# EAGLE schematic Imagenotifier (EAGLE 7.5.0)
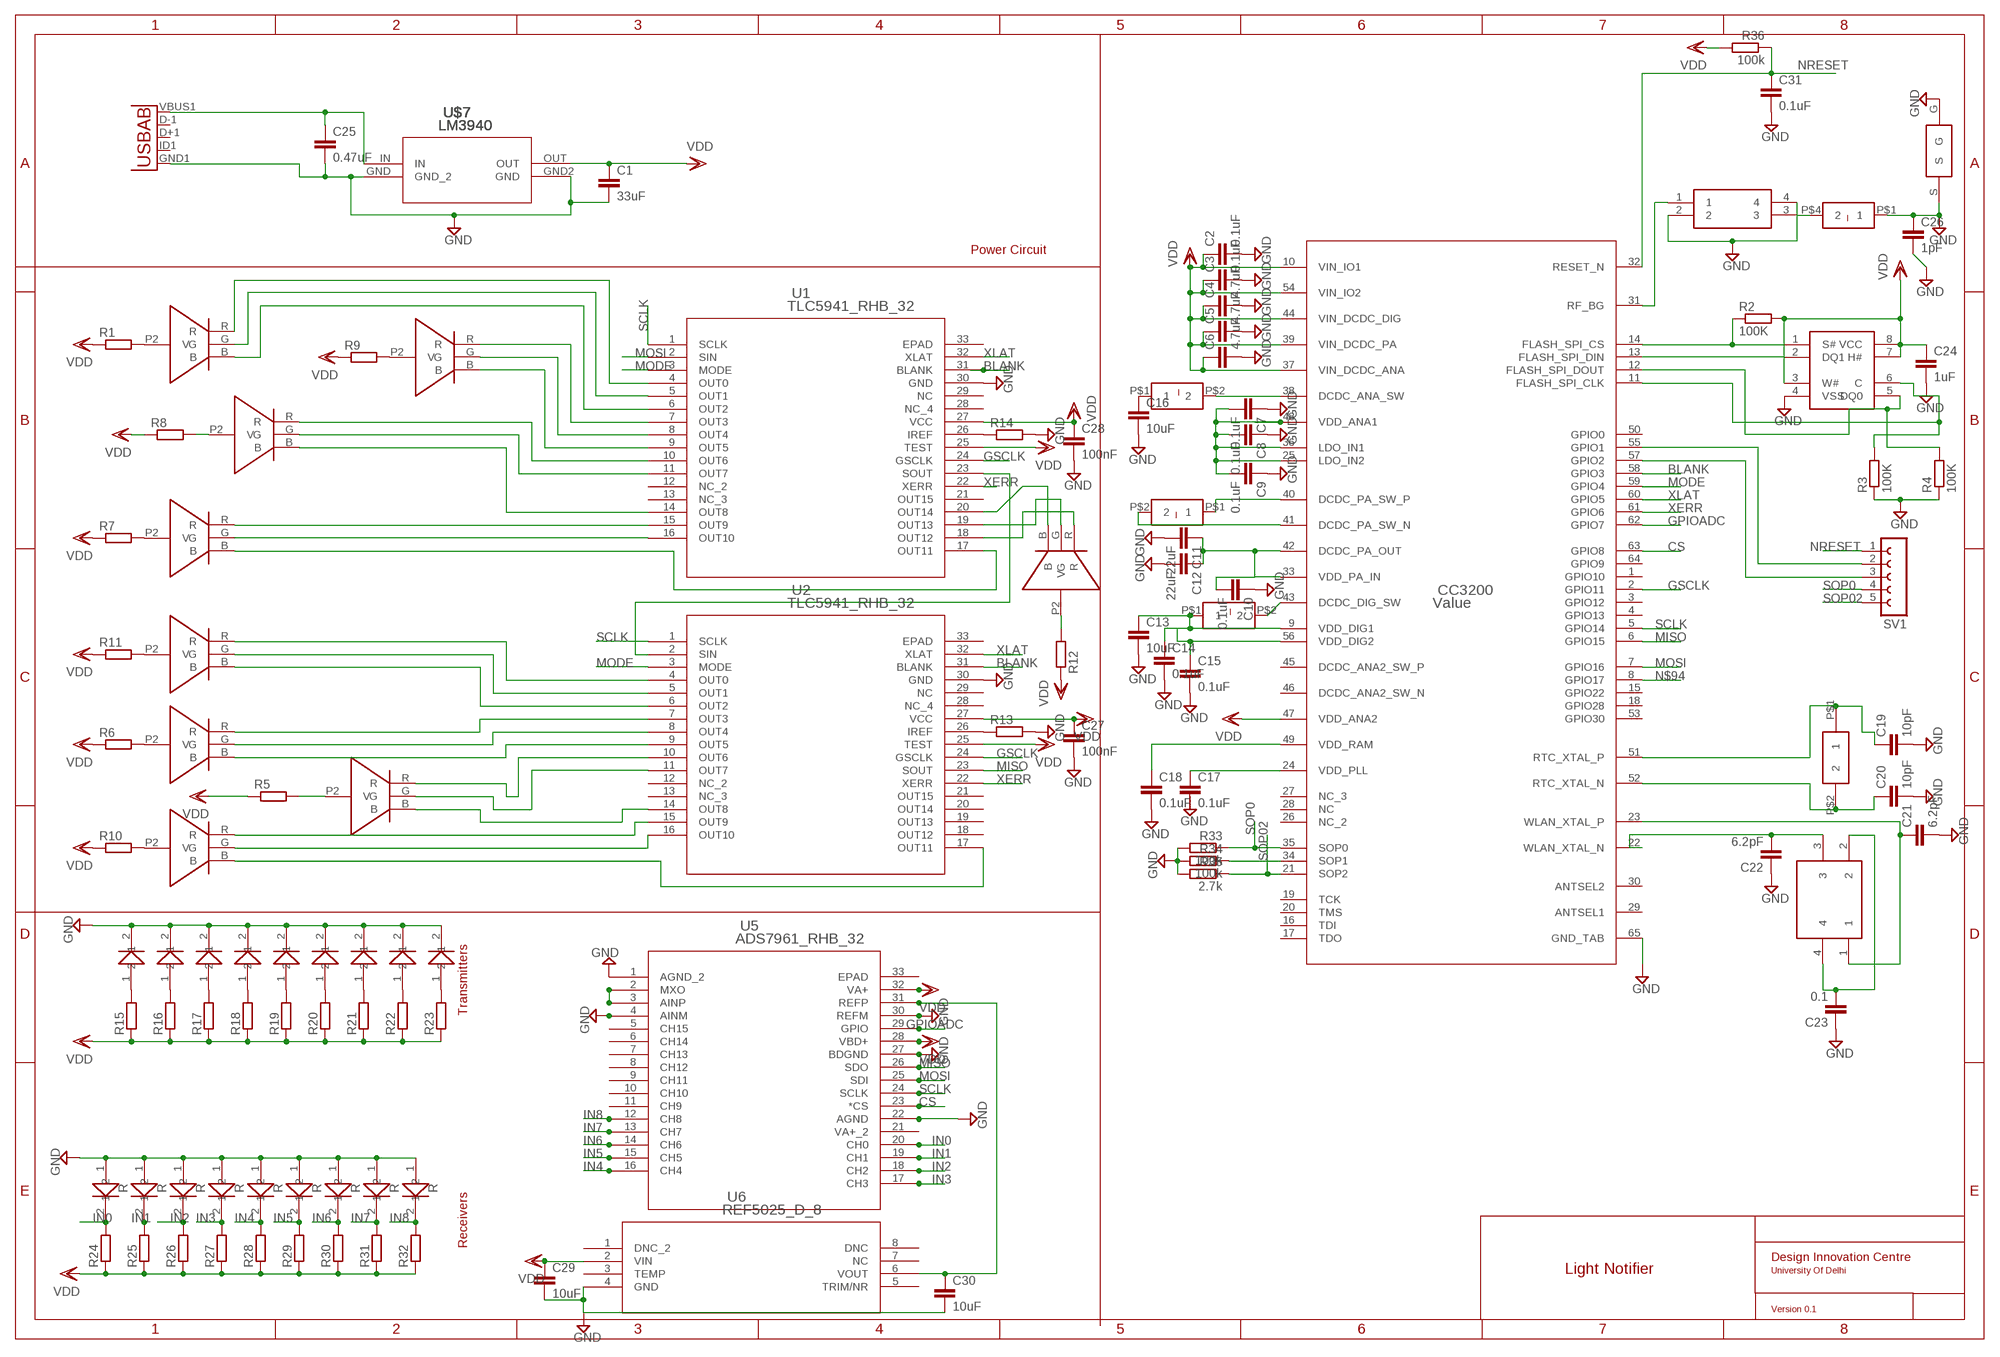
[diagram p0: schematic, sheet 1]

## Parts
1  IRTRANS  [IRTRANSCIEVER]
C1  33uF  CC1206  [C1206]
C2  0.1uF  CAP0805  [0805]
C3  0.1uF  CAP0805  [0805]
C4  4.7uF  CAP0805  [0805]
C5  4.7uF  CAP0805  [0805]
C6  4.7uF  CAP0805  [0805]
C7  0.1uF  CAP0805  [0805]
C8  0.1uF  CAP0805  [0805]
C9  0.1uF  CAP0805  [0805]
C10  0.1uF  CAP0805  [0805]
C11  22uF  CAP0805  [0805]
C12  22uF  CAP0805  [0805]
C13  10uF  CAP0805  [0805]
C14  0.1uF  CAP0805  [0805]
C15  0.1uF  CAP0805  [0805]
C16  10uF  CAP0805  [0805]
C17  0.1uF  CAP0805  [0805]
C18  0.1uF  CAP0805  [0805]
C19  10pF  CAP0805  [0805]
C20  10pF  CAP0805  [0805]
C21  6.2pF  CAP0805  [0805]
C22  6.2pF  CAP0805  [0805]
C23  0.1  CAP0805  [0805]
C24  1uF  CAP0805  [0805]
C25  0.47uF  C  [C0805]
C26  1pF  CAP0805  [0805]
C27  100nF  CAP0805  [0805]
C28  100nF  CAP0805  [0805]
C29  10uF  CAP0805  [0805]
C30  10uF  CAP0805  [0805]
C31  0.1uF  CAP0805  [0805]
CC3200  Value  CC3200R1M2RGCR  [RGC0064A]
CRYSTAL  ABS07-32.768KHZ-T  [ABS07-32.768KHZ-T]
R1  R  [R0805]
R2  100K  R  [R0805]
R3  100K  R  [R0805]
R4  100K  R  [R0805]
R5  R  [R0805]
R6  R  [R0805]
R7  R  [R0805]
R8  R  [R0805]
R9  R  [R0805]
R10  R  [R0805]
R11  R  [R0805]
R12  R  [R0805]
R13  R  [R0805]
R14  R  [R0805]
R15  R  [R0805]
R16  R  [R0805]
R17  R  [R0805]
R18  R  [R0805]
R19  R  [R0805]
R20  R  [R0805]
R21  R  [R0805]
R22  R  [R0805]
R23  R  [R0805]
R24  R  [R0805]
R25  R  [R0805]
R26  R  [R0805]
R27  R  [R0805]
R28  R  [R0805]
R29  R  [R0805]
R30  R  [R0805]
R31  R  [R0805]
R32  R  [R0805]
R33  100k  R  [R0805]
R34  100k  R  [R0805]
R35  2.7k  R  [R0805]
R36  100k  R  [R0805]
SV1  FE05-1  [FE05-1]
U1  TLC5941_RHB_32  [RHB32_3P15X3P15]
U2  TLC5941_RHB_32  [RHB32_3P15X3P15]
U3  USB""  [USB-MICRO-SMD]
U5  ADS7961_RHB_32  [RHB32_2P7X2P7]
U6  REF5025_D_8  [D8]
U$1  IND1UH1008P  [1008IND2.2UH]
U$2  IND2.6UH1008P  [1008IND2.2UH]
U$3  IND2.6UH1008P  [1008IND2.2UH]
U$5  Q24FA20H00396  [Q24FA20H00396]
U$6  FLASHM25PX80  [SO08]
U$7  LM3940  [MP04A]
U$8  DEA202450BT-1294C1-H  [DEA202450BT-1294C1-H]
U$9  IND3.6NH402P  [0402INDUCTOR3.6NH]
U$10  ANTENNAE-AH316M245001-T  [ANTENNA-AH316M245001-T]
U$11  RGBLED  [0.25WATT_RGB_THROUGH]
U$12  RGBLED  [0.25WATT_RGB_THROUGH]
U$13  RGBLED  [0.25WATT_RGB_THROUGH]
U$14  RGBLED  [0.25WATT_RGB_THROUGH]
U$15  RGBLED  [0.25WATT_RGB_THROUGH]
U$16  RGBLED  [0.25WATT_RGB_THROUGH]
U$17  RGBLED  [0.25WATT_RGB_THROUGH]
U$18  RGBLED  [0.25WATT_RGB_THROUGH]
U$19  RGBLED  [0.25WATT_RGB_THROUGH]
U$20  IRTRANS  [IRTRANSCIEVER]
U$22  IRTRANS  [IRTRANSCIEVER]
U$23  IRTRANS  [IRTRANSCIEVER]
U$24  IRTRANS  [IRTRANSCIEVER]
U$25  IRTRANS  [IRTRANSCIEVER]
U$26  IRTRANS  [IRTRANSCIEVER]
U$27  IRTRANS  [IRTRANSCIEVER]
U$28  IRTRANS  [IRTRANSCIEVER]
U$29  IRREC  [IRREIVER]
U$31  IRREC  [IRREIVER]
U$33  IRREC  [IRREIVER]
U$35  IRREC  [IRREIVER]
U$37  IRREC  [IRREIVER]
U$39  IRREC  [IRREIVER]
U$41  IRREC  [IRREIVER]
U$43  IRREC  [IRREIVER]
U$44  IRREC  [IRREIVER]

## Nets
BLANK: CC3200.58(GPIO3) U1.31(BLANK) U2.31(BLANK)
CS: CC3200.63(GPIO8) U5.23(*CS)
GND: 1.2 C1.2 C2.2 C3.2 C4.2 C5.2 C6.2 C7.1 C8.1 C9.1 C10.1 C11.2 C12.2 C13.2 C14.2 C15.2 C16.2 C18.2 C19.2 C20.2 C21.2 C22.1 C23.1 C24.2 C25.2 C26.1 C26.2 C27.2 C28.2 C29.2 C30.2 C31.2 CC3200.65(GND_TAB) R3.1 R4.1 R13.2 R14.2 R33.2 R34.2 R35.2 U1.30(GND) U2.30(GND) U3.GND1(GND) U5.4(AINM) U5.22(AGND) U5.27(BDGND) U5.30(REFM) U6.4(GND) U$6.4(VSS) U$7.GND2(GND) U$7.GND(GND_2) U$8.2 U$8.4 U$9.P$1 U$10.G U$10.S U$20.2 U$22.2 U$23.2 U$24.2 U$25.2 U$26.2 U$27.2 U$28.2 U$29.1 U$31.1 U$33.1 U$35.1 U$37.1 U$39.1 U$41.1 U$43.1 U$44.1
GPIOADC: CC3200.62(GPIO7) U5.29(GPIO)
GSCLK: CC3200.2(GPIO11) U1.24(GSCLK) U2.24(GSCLK)
IN0: R24.2 U5.20(CH0) U$29.2
IN1: R25.2 U5.19(CH1) U$31.2
IN2: R26.2 U5.18(CH2) U$33.2
IN3: R27.2 U5.17(CH3) U$35.2
IN4: R28.2 U5.16(CH4) U$37.2
IN5: R29.2 U5.15(CH5) U$39.2
IN6: R30.2 U5.14(CH6) U$41.2
IN7: R31.2 U5.13(CH7) U$43.2
IN8: R32.2 U5.12(CH8) U$44.2
MISO: CC3200.6(GPIO15) U2.23(SOUT) U5.26(SDO)
MODE: CC3200.59(GPIO4) U1.3(MODE) U2.3(MODE)
MOSI: CC3200.7(GPIO16) U1.2(SIN) U5.25(SDI)
N$1: C7.2 C8.2 C9.2 CC3200.25(LDO_IN2) CC3200.36(LDO_IN1) CC3200.48(VDD_ANA1)
N$2: CC3200.40(DCDC_PA_SW_P) U$1.P$1
N$3: CC3200.41(DCDC_PA_SW_N) U$1.P$2
N$4: C10.2 C11.1 C12.1 CC3200.33(VDD_PA_IN) CC3200.42(DCDC_PA_OUT)
N$5: C13.1 C14.1 CC3200.9(VDD_DIG1) U$3.P$1
N$6: CC3200.43(DCDC_DIG_SW) U$3.P$2
N$7: C15.1 CC3200.56(VDD_DIG2)
N$8: CC3200.38(DCDC_ANA_SW) U$2.P$2
N$9: C16.1 U$2.P$1
N$10: C18.1 CC3200.49(VDD_RAM)
N$11: C17.1 CC3200.24(VDD_PLL)
N$12: C19.1 CC3200.51(RTC_XTAL_P) CRYSTAL.P$1
N$13: C20.1 CC3200.52(RTC_XTAL_N) CRYSTAL.P$2
N$14: C21.1 CC3200.23(WLAN_XTAL_P) U$5.1
N$15: C22.2 CC3200.22(WLAN_XTAL_N) U$5.3
N$16: C23.2 U$5.2 U$5.4
N$17: CC3200.14(FLASH_SPI_CS) R2.1 U$6.1(S#)
N$18: CC3200.13(FLASH_SPI_DIN) U$6.2(DQ1)
N$19: CC3200.11(FLASH_SPI_CLK) R3.2 U$6.6(C)
N$20: C25.1 U3.VBUS1(VBUS) U$7.IN
N$22: CC3200.31(RF_BG) U$8.1
N$23: U$8.3 U$9.P$4
N$24: R1.2 U$11.P2(V)
N$25: R5.2 U$14.P2(V)
N$26: R6.2 U$17.P2(V)
N$27: R7.2 U$12.P2(V)
N$28: R8.2 U$18.P2(V)
N$29: R9.2 U$15.P2(V)
N$30: R10.2 U$19.P2(V)
N$31: R11.2 U$16.P2(V)
N$32: R12.2 U$13.P2(V)
N$33: U1.4(OUT0) U$11.R
N$34: U1.5(OUT1) U$11.G
N$35: U1.6(OUT2) U$11.B
N$36: U1.7(OUT3) U$15.R
N$37: U1.8(OUT4) U$15.G
N$38: U1.9(OUT5) U$15.B
N$39: U1.10(OUT6) U$18.R
N$40: U1.11(OUT7) U$18.G
N$41: U1.14(OUT8) U$18.B
N$42: U1.15(OUT9) U$12.R
N$43: U1.16(OUT10) U$12.G
N$44: U1.17(OUT11) U$12.B
N$45: U1.18(OUT12) U$13.R
N$46: U1.19(OUT13) U$13.G
N$47: U1.20(OUT14) U$13.B
N$48: U2.4(OUT0) U$16.R
N$49: U2.5(OUT1) U$16.G
N$50: U2.6(OUT2) U$16.B
N$51: U2.7(OUT3) U$17.R
N$52: U2.9(OUT5) U$17.B
N$53: U2.10(OUT6) U$14.R
N$54: U2.8(OUT4) U$17.G
N$55: U2.11(OUT7) U$14.G
N$56: U2.14(OUT8) U$14.B
N$57: U5.2(MXO) U5.3(AINP)
N$58: U2.15(OUT9) U$19.R
N$59: U2.16(OUT10) U$19.G
N$60: U2.17(OUT11) U$19.B
N$61: U1.23(SOUT) U2.2(SIN)
N$62: 1.1 R15.2
N$63: R14.1 U1.26(IREF)
N$64: R16.2 U$22.1
N$65: R13.1 U2.26(IREF)
N$72: C30.1 U5.31(REFP) U6.6(VOUT)
N$73: U5.1(AGND_2)
N$74: CC3200.34(SOP1) R34.1
N$75: CC3200.55(GPIO1) SV1.2
N$76: CC3200.57(GPIO2) SV1.3
N$83: R17.2 U$23.1
N$84: R18.2 U$24.1
N$85: R19.2 U$25.1
N$86: R20.2 U$26.1
N$87: R21.2 U$27.1
N$88: R22.2 U$28.1
N$89: R23.2 U$20.1
N$94: CC3200.8(GPIO17)
N$110: CC3200.12(FLASH_SPI_DOUT) R4.2 U$6.5(DQ0)
NRESET: C31.1 CC3200.32(RESET_N) R36.1 SV1.1
SCLK: CC3200.5(GPIO14) U1.1(SCLK) U2.1(SCLK) U5.24(SCLK)
SOP0: CC3200.35(SOP0) R33.1 SV1.4
SOP02: CC3200.21(SOP2) R35.1 SV1.5
VDD: C1.1 C2.1 C3.1 C4.1 C5.1 C6.1 C24.1 C27.1 C28.1 C29.1 CC3200.10(VIN_IO1) CC3200.37(VIN_DCDC_ANA) CC3200.39(VIN_DCDC_PA) CC3200.44(VIN_DCDC_DIG) CC3200.47(VDD_ANA2) CC3200.54(VIN_IO2) R1.1 R2.2 R5.1 R6.1 R7.1 R8.1 R9.1 R10.1 R11.1 R12.1 R15.1 R16.1 R17.1 R18.1 R19.1 R20.1 R21.1 R22.1 R23.1 R24.1 R25.1 R26.1 R27.1 R28.1 R29.1 R30.1 R31.1 R32.1 R36.2 U1.25(TEST) U1.27(VCC) U2.25(TEST) U2.27(VCC) U5.28(VBD+) U5.32(VA+) U6.2(VIN) U$6.3(W#) U$6.7(H#) U$6.8(VCC) U$7.OUT
XERR: CC3200.61(GPIO6) U1.22(XERR) U2.22(XERR)
XLAT: CC3200.60(GPIO5) U1.32(XLAT) U2.32(XLAT)
Unconnected: C17.2 CC3200.1(GPIO10) CC3200.3(GPIO12) CC3200.4(GPIO13) CC3200.15(GPIO22) CC3200.16(TDI) CC3200.17(TDO) CC3200.18(GPIO28) CC3200.19(TCK) CC3200.20(TMS) CC3200.26(NC_2) CC3200.27(NC_3) CC3200.28(NC) CC3200.29(ANTSEL1) CC3200.30(ANTSEL2) CC3200.45(DCDC_ANA2_SW_P) CC3200.46(DCDC_ANA2_SW_N) CC3200.50(GPIO0) CC3200.53(GPIO30) CC3200.64(GPIO9) U1.12(NC_2) U1.13(NC_3) U1.21(OUT15) U1.28(NC_4) U1.29(NC) U1.33(EPAD) U2.12(NC_2) U2.13(NC_3) U2.18(OUT12) U2.19(OUT13) U2.20(OUT14) U2.21(OUT15) U2.28(NC_4) U2.29(NC) U2.33(EPAD) U3.D+1(D+) U3.D-1(D-) U3.ID1(USBID) U5.5(CH15) U5.6(CH14) U5.7(CH13) U5.8(CH12) U5.9(CH11) U5.10(CH10) U5.11(CH9) U6.1(DNC_2) U6.3(TEMP) U6.5(TRIM/NR) U6.7(NC) U6.8(DNC)

## Notes on the sheet
- Power Circuit
- Transmitters
- Receivers

## Power pins joined to a net without a drawn wire
EPAD: U5.33(EPAD)
VA+_2: U5.21(VA+_2)

## Library data of the parts
1 U$20 U$22-U$28 = Components:IRTRANS
C1 C25 = eagle-ltspice:C: CAPACITOR, European symbol; SPICEMODEL: NONE; SPICEPREFIX: C
C2-C24 C26-C31 = SparkFun-Capacitors:CAP: Capacitor Standard 0603 ceramic capacitor, and 0.1" leaded capacitor.
CC3200 = CC3200:CC3200R1M2RGCR; ALTERNATEPARTNUMBER: CC3200R1M2RGC; COMPTYPE: IC; MANUFACTURER: Texas Instruments; MOUNTTYPE: SMT; PACKAGEREFERENCE: RGC0064A; PARTNUMBER: CC3200R1M2RGCR; PIN_COUNT: 65; REFDES: RefDes; ROHS: Y; TYPE: TYPE
CRYSTAL = Components:ABS07-32.768KHZ-T
R1-R36 = eagle-ltspice:R: RESISTOR, European symbol; SPICEMODEL: NONE; SPICEPREFIX: R
SV1 = con-lsta:FE05-1: FEMALE HEADER; OC_FARNELL: unknown; OC_NEWARK: unknown
U1 U2 = Components:TLC5941_RHB_32; DATASHEETURL: http://www.ti.com/lit/gpn/TLC5941; DESCRIPTION: 16 Channel LED Driver with Dot Correction and Grayscale PWM Control; FAMILY_NAME: LED DRIVER; GENERIC_PART_NUMBER: TLC5941; INDUSTRY_STD_PKG_TYPE: QFN; MANUFACTURER: Texas Instruments; MANUFACTURER_PART_NUMBER: tlc5941_rhb_32; PACKAGE_DESIGNATOR: RHB; PIN_COUNT: 32; VENDOR: Texas Instruments
U3 = MicroUSB:USB: This is a USB AB connector that is compatible with USB OTG. i.e. this connector can serve as a host or device
U5 = Components:ADS7961_RHB_32; DATASHEETURL: http://www.ti.com/lit/gpn/ADS7961; DESCRIPTION: 8 Bit, 1 MSPS, 16 Ch, Single Ended, Micro Power, sr i/f, SAR ADC; FAMILY_NAME: PRECISION ADC (<=10MSPS); GENERIC_PART_NUMBER: ADS7961; INDUSTRY_STD_PKG_TYPE: QFN; MANUFACTURER: Texas Instruments; PACKAGE_DESIGNATOR: RHB; PIN_COUNT: 32
U6 = Components:REF5025_D_8; DATASHEETURL: http://www.ti.com/lit/gpn/REF5025; DESCRIPTION: Low Noise, Very Low Drift, Precision Voltage Reference; FAMILY_NAME: SERIES VOLTAGE REFERENCE; GENERIC_PART_NUMBER: REF5025; INDUSTRY_STD_PKG_TYPE: SOIC; MANUFACTURER: Texas Instruments; MANUFACTURER_PART_NUMBER: ref5025_d_8; PACKAGE_DESIGNATOR: D; PIN_COUNT: 8; VENDOR: Texas Instruments
U$1 = Components:IND1UH1008P
U$2 U$3 = Components:IND2.6UH1008P
U$5 = Components:Q24FA20H00396
U$6 = Components:FLASHM25PX80
U$7 = Components:LM3940
U$8 = Components:DEA202450BT-1294C1-H
U$9 = Components:IND3.6NH402P
U$10 = Components:ANTENNAE-AH316M245001-T
U$11-U$19 = Components:RGBLED
U$29 U$31 U$33 U$35 U$37 U$39 U$41 U$43 U$44 = Components:IRREC